# Altium schematic sheet MEDICION_CORRIENTE.SchDoc
size A
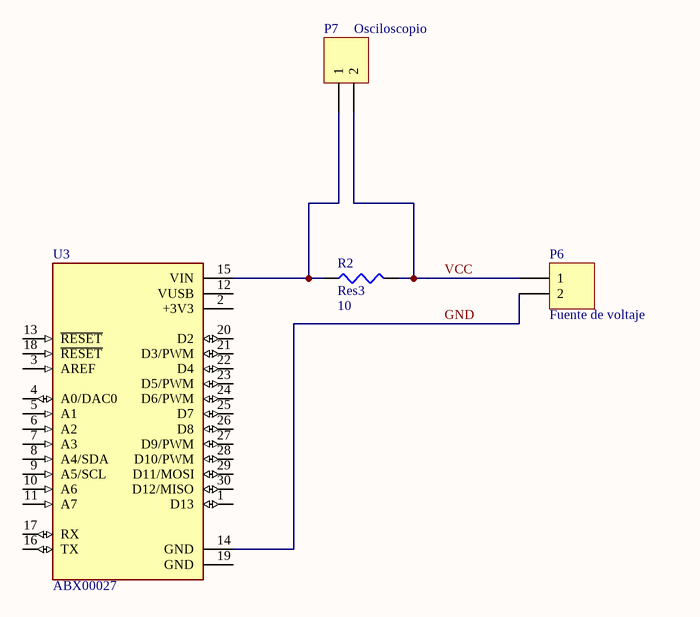
[diagram p0: MEDICION_CORRIENTE.SchDoc]

## Parts
P6  Fuente de voltaje  [HDR1X2]
P7  Osciloscopio  [HDR1X2]
R2  Res3  value 10  [J1-0603]
U3  ABX00027  [MODULE_ABX00027]

## Nets
GND: P6.2 U3.14(GND)
VCC: P6.1 P7.2 R2.2
NetP7_1: P7.1 R2.1 U3.15(VIN)

Not connected (* = marked no-connect by the designer): U3 1(D13) 2(+3V3) 3(AREF) 4(A0/DAC0) 5(A1) 6(A2) 7(A3) 8(A4/SDA) 9(A5/SCL) 10(A6) 11(A7) 12(VUSB) 13(~{RESET}) 16(TX) 17(RX) 18(~{RESET}) 19(GND) 20(D2) 21(D3/PWM) 22(D4) 23(D5/PWM) 24(D6/PWM) 25(D7) 26(D8) 27(D9/PWM) 28(D10/PWM) 29(D11/MOSI) 30(D12/MISO)

## Library data of the parts
P6 P7 = Header 2: Header, 2-Pin; LatestRevisionDate: 17-Jul-2002; LatestRevisionNote: Re-released for DXP Platform.; Publisher: Altium Limited
R2 = Res3: Resistor; Published: 8-Jun-2000; LatestRevisionDate: 29-May-2009; LatestRevisionNote: IPC-7351 Footprint Added.; PackageReference: J1-0603; Publisher: Altium Limited; PackageDescription: Chip Resistor
U3 = ABX00027: ATSAMD21G18A Arduino Nano 33 IoT SAM D ARMÂ® CortexÂ®-M0+ MCU 32-Bit Embedded Evaluation Board; MF: {'manufacturer': u'Arduino'}; MP: ABX00027; Availability: Unavailable; Value: *; Package: None; Price: None